# EAGLE design board (EAGLE 6.4)
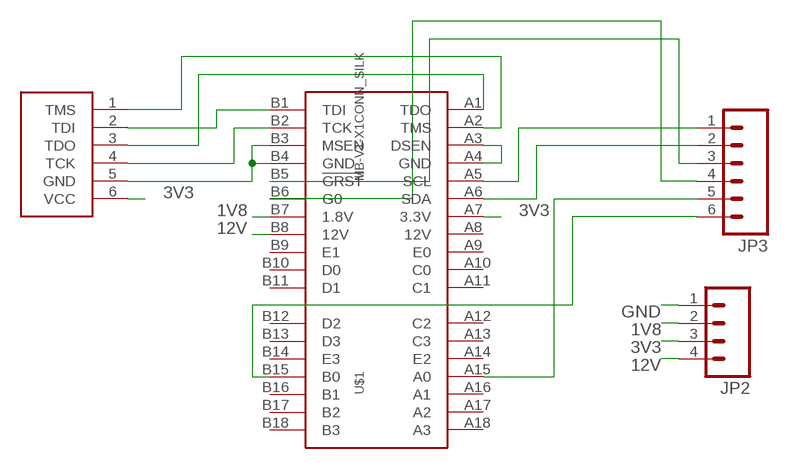
[diagram p0: schematic, sheet 1]

## Parts
JP2  M04PTH  [1X04]
JP3  M06SIP  [1X06]
U$1  MB-V1-X1CONN_SILK  [MB-V1-X1-CONN]
U$2  JTAGDIGILENT  [1X06]

## Nets
1V8: JP2.2 U$1.B7(1.8V)
3V3: JP2.3 U$1.A7(3.3V) U$2.6(VCC)
12V: JP2.4 U$1.B8(12V)
A0: JP3.5 U$1.A15(A0)
B0: JP3.6 U$1.B15(B0)
G0: JP3.4 U$1.B6(G0)
GND: JP2.1 U$1.B3(MSEN) U$1.B4(GND) U$2.5(GND)
GRST: JP3.3 U$1.B5(!GRST)
N$1: U$1.A3(DSEN) U$1.A4(GND)
SCL: JP3.1 U$1.A5(SCL)
SDA: JP3.2 U$1.A6(SDA)
TCK: U$1.B2(TCK) U$2.4(TCK)
TDI: U$1.B1(TDI) U$2.2(TDI)
TDO: U$1.A1(TDO) U$2.3(TDO)
TMS: U$1.A2(TMS) U$2.1(TMS)
Unconnected: U$1.A8(12V) U$1.A9(E0) U$1.A10(C0) U$1.A11(C1) U$1.A12(C2) U$1.A13(C3) U$1.A14(E2) U$1.A16(A1) U$1.A17(A2) U$1.A18(A3) U$1.B9(E1) U$1.B10(D0) U$1.B11(D1) U$1.B12(D2) U$1.B13(D3) U$1.B14(E3) U$1.B16(B1) U$1.B17(B2) U$1.B18(B3)

## Library data of the parts
JP2 = SparkFun-Connectors:M04: Header 4 Standard 4-pin 0.1" header. Use with straight break away headers (SKU : PRT-00116), right angle break away headers (PRT-00553), swiss pins (PRT-00743), machine pins (PRT-00117), and female headers (PRT-00115). Molex polarized connector foot print use with SKU : PRT-08231 with associated crimp pins and housings. 1MM SMD Version SKU: PRT-10208
JP3 = SparkFun-Connectors:M06: Header 6 Standard 6-pin 0.1" header. Use with straight break away headers (SKU : PRT-00116), right angle break away headers (PRT-00553), swiss pins (PRT-00743), machine pins (PRT-00117), and female headers (PRT-00115). Molex polarized connector foot print use with SKU : PRT-08094 with associated crimp pins and housings. NOTES ON THE VARIANTS LOCK and LOCK_LONGPADS... This footprint was designed to help hold the alignment of a through-hole component (i.e. 6-pin header) while soldering it into place. You may notice that each hole has been shifted either up or down by 0.005 of an inch from it's more standard position (which is a perfectly straight line). This slight alteration caused the pins (the squares in the middle) to touch the edges of the holes. Because they are alternating, it causes a "brace" to hold the component in place. 0.005 has proven to be the perfect amount of "off-center" position when using our standard breakaway headers. Although looks a little odd when you look at the bare footprint, once you have a header in there, the alteration is very hard to notice. Also,if you push a header all the way into place, it is covered up entirely on the bottom side. This idea of altering the position of holes to aid alignment will be further integrated into the Sparkfun Library for other footprints. It can help hold any component with 3 or more connection pins.
U$1 = kmod-connectors:MB-V1-X1
U$2 = kmod-connectors:JTAG: JTAG connector, as on the Digilent Nexys3

## Net classes
0 default: width 0.305 mm

## Board
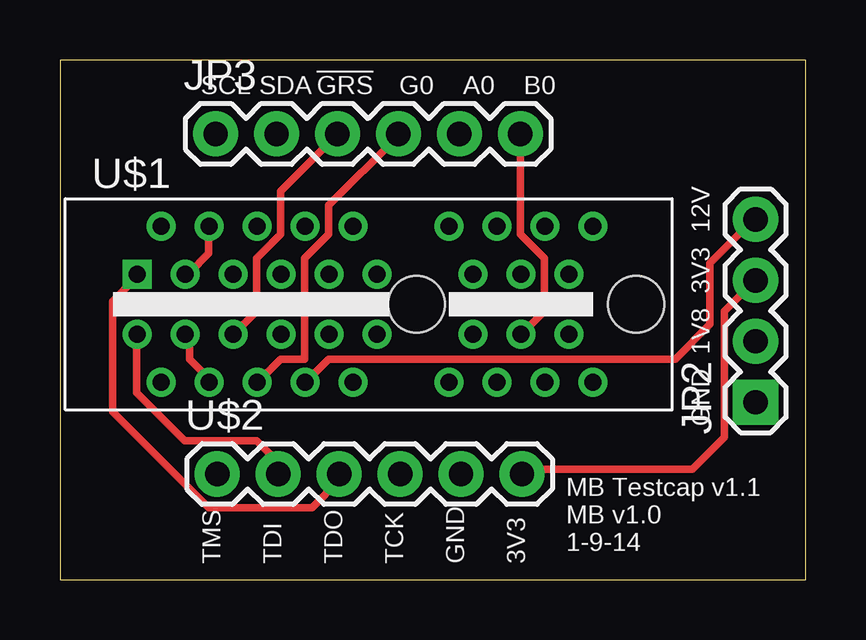
[diagram p1: board, top side]
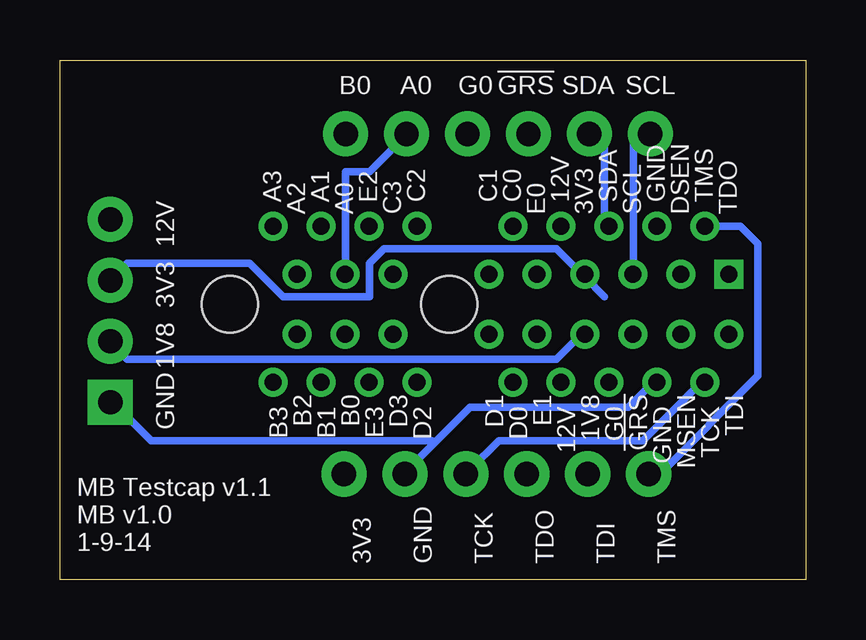
[diagram p2: board, bottom side, seen from below]

Size 31.1 x 21.66 mm. Coordinates in mm from the lower left corner, seen from the top.
Outline: 0,0 31.1,0 31.1,21.66 0,21.66 0,0
Copper layers (1*16): Top 0.0356mm / dielectric 1.5011mm / Bottom 0.0356mm
Design rules "OSHPark_mine": minimum track width 6mil, minimum drill 13mil, track to track 6mil, track to pad 6mil, pad to pad 6mil, via to via 6mil, smd to smd 6mil, copper to edge 15mil, drill to drill 6mil, minimum pad ring 7mil, minimum via ring 7mil, stop-mask expansion 2mil, vias tented up to drill 13mil, thermal gap 10mil

### Footprints (pad centres in the part's own frame; a part is rotated, then mirrored left to right if it is on the bottom)
1X04 = drill 1.016 pad 1.88 square: 1 0,0 | drill 1.016 pad 1.88: 2 2.54,0; 3 5.08,0; 4 7.62,0
1X06 = drill 1.016 pad 1.88: 1 0,0; 2 2.54,0; 3 5.08,0; 4 7.62,0; 5 10.16,0; 6 12.7,0
MB-V1-X1-CONN = drill 0.7 pad 1.2 square: A1 -11.65,1.25 | drill 0.7 pad 1.2: A2 -10.65,3.25; A3 -9.65,1.25; A4 -8.65,3.25; A5 -7.65,1.25; A6 -6.65,3.25; A7 -5.65,1.25; A8 -4.65,3.25; A9 -3.65,1.25; A10 -2.65,3.25; A11 -1.65,1.25; A12 1.35,3.25; A13 2.35,1.25; A14 3.35,3.25; A15 4.35,1.25; A16 5.35,3.25; A17 6.35,1.25; A18 7.35,3.25; B1 -11.65,-1.25; B2 -10.65,-3.25; B3 -9.65,-1.25; B4 -8.65,-3.25; B5 -7.65,-1.25; B6 -6.65,-3.25; B7 -5.65,-1.25; B8 -4.65,-3.25; B9 -3.65,-1.25; B10 -2.65,-3.25; B11 -1.65,-1.25; B12 1.35,-3.25; B13 2.35,-1.25; B14 3.35,-3.25; B15 4.35,-1.25; B16 5.35,-3.25; B17 6.35,-1.25; B18 7.35,-3.25 | hole 2.35: 0,0; 9.15,0

### Placement (x,y rotation side)
JP2  29,7.4 90 top
JP3  6.49,18.58 0 top
U$1  14.87,11.48 0 top
U$2  6.56,4.41 0 top

### Tracks (layer width: path | path; a pad name or v marks a point on that pad's centre or on a via)
1V8
  Bottom 0.305: JP2.2 28.9,9.8 28.3,9.2 10.4,9.2 9.4,10.2 U$1.B7
3V3
  Top 0.305: U$2.6 19.4,4.6 26.36,4.6 27.7,5.94 27.7,11.2 28.9,12.4 JP2.3
  Bottom 0.305: 8.4,11.8 9.2,12.6 U$1.A7 9.4,12.8 10.4,13.8 17.6,13.8 18.2,13.2 18.2,11.8 21.8,11.8 23.2,13.2 28.3,13.2 28.9,12.6 JP2.3
12V
  Top 0.305: U$1.B8 10.4,8.4 11.2,9.2 25.66,9.2 27.1,10.64 27.1,13.2 28.9,15 JP2.4
A0
  Bottom 0.305: U$1.A15 19.2,12.8 19.2,17 18.2,17 16.8,18.4 JP3.5
B0
  Top 0.305: JP3.6 19.2,14.4 20.2,13.4 20.2,11.2 19.4,10.4 U$1.B15
G0
  Top 0.305: U$1.B6 8.4,8.4 9.2,9.2 10.2,9.2 10.2,13.4 11.2,14.4 11.2,15.6 14,18.4 JP3.4
GND
  Top 0.305: U$1.B4 6.2,8.4 5.4,9.2 5.4,10.2 U$1.B3
  Bottom 0.305: 15.5,5.7 14,7.2 7.4,7.2 6.4,8.2 U$1.B4 | 15.5,5.7 16.6,4.6 U$2.5 | JP2.1 28.9,7.4 27.3,5.8 15.6,5.8 15.5,5.7
GRST
  Top 0.305: U$1.B5 7.4,10.4 8.2,11.2 8.2,13.4 9.2,14.4 9.2,16.2 11.4,18.4 JP3.3
N$1
  Top 0.305: U$1.A3 5.4,12.8 6.2,13.6 6.2,14.6 U$1.A4
SCL
  Bottom 0.305: JP3.1 7.2,18.4 7.2,12.8 U$1.A5
SDA
  Bottom 0.305: JP3.2 8.4,18.4 8.4,14.8 U$1.A6
TCK
  Bottom 0.305: U$1.B2 4.4,8.2 6.8,5.8 12.8,5.8 14,4.6 U$2.4
TDI
  Top 0.305: U$1.B1 3.2,10.2 3.2,7.8 5.2,5.8 8.2,5.8 9.1,4.9 U$2.2
TDO
  Top 0.305: U$1.A1 3.2,12.6 2.2,11.6 2.2,7 6.2,3 10.5,3 11.64,4.14 U$2.3 11.6,4.4
TMS
  Bottom 0.305: U$2.1 6.09,4.41 2,8.5 2,14 2.73,14.73 U$1.A2

### Text on the board
tPlace: SCL | SDA | !GRS | G0 | A0 | B0 | 12V | 3V3 | 1V8 | GND | TMS | TDI | TDO | TCK | GND | 3V3 | MB Testcap v1.1 / MB v1.0 / 1-9-14
bPlace: SCL | SDA | !GRS | G0 | A0 | B0 | 12V | 3V3 | 1V8 | GND | TMS | TDI | TDO | TCK | GND | 3V3 | MB Testcap v1.1 / MB v1.0 / 1-9-14